# EAGLE board Controller-b (EAGLE 6.3)
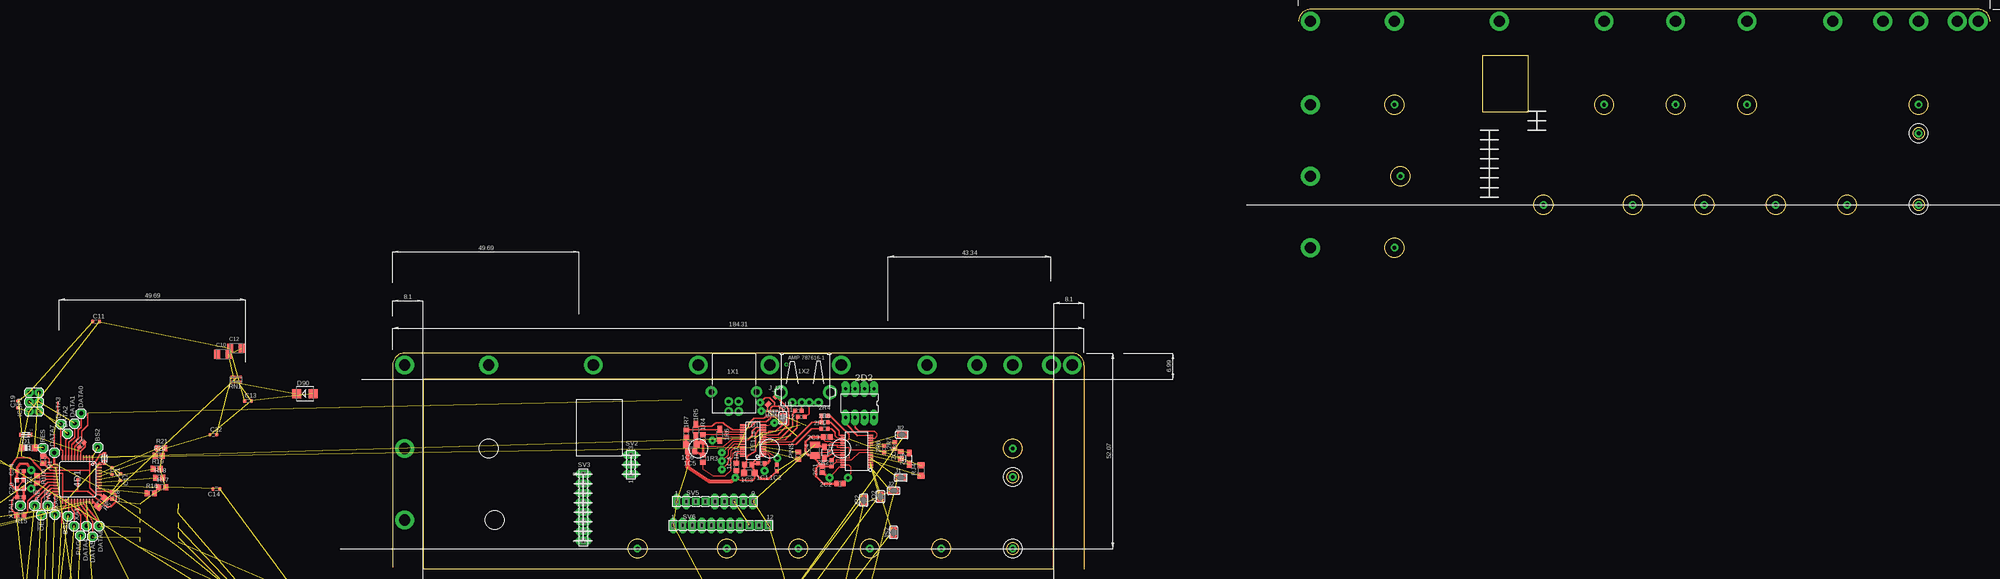
[diagram p8: board, top side]
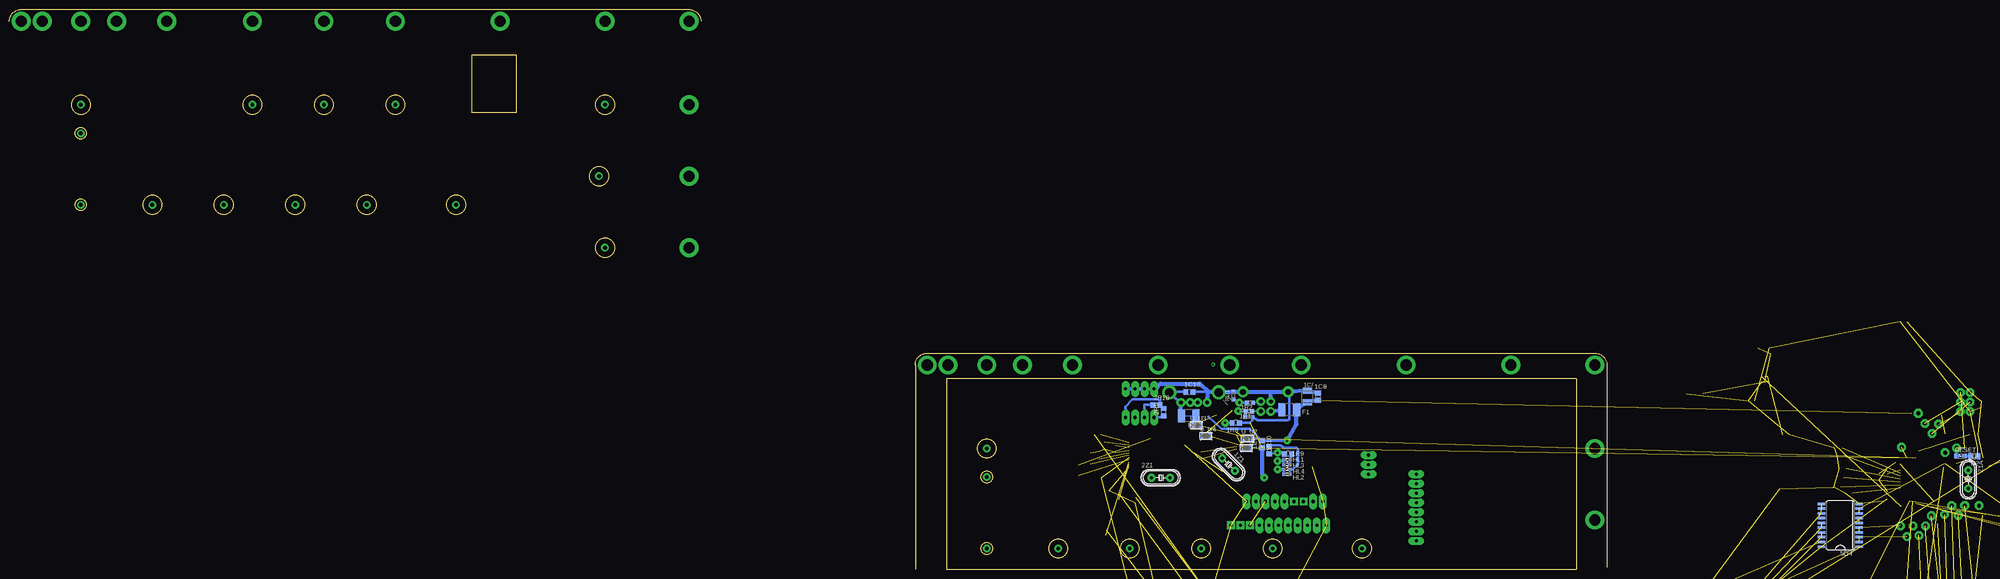
[diagram p9: board, bottom side, seen from below]

Size 425.77 x 149.22 mm. Coordinates in mm from the lower left corner, seen from the top.
Outline: 425.77,146.05 arc90 422.59,149.23 244.63,149.23 arc90 241.46,146.05
Outline: 0,0.64 0,54.45 arc-90 3.17,57.63 181.13,57.63 arc-90 184.31,54.45 184.31,0
Outline: 8.1,50.8 176.05,50.8 176.05,0 8.1,0 8.1,50.8
Outline: 290.51,137 302.58,137 302.58,121.76 290.51,121.76 290.51,137
Outline: circle at 165.26,5.56 radius 1.5
Outline: circle at 146.21,5.56 radius 2.5
Outline: circle at 127.16,5.56 radius 2.5
Outline: circle at 108.11,5.56 radius 2.5
Outline: circle at 89.06,5.56 radius 2.5
Outline: circle at 165.26,24.61 radius 1.5
Outline: circle at 165.26,32.23 radius 2.5
Outline: circle at 65.25,5.56 radius 2.5
Outline: circle at 406.72,97.16 radius 1.5
Outline: circle at 387.67,97.16 radius 2.5
Outline: circle at 368.62,97.16 radius 2.5
Outline: circle at 349.57,97.16 radius 2.5
Outline: circle at 330.52,97.16 radius 2.5
Outline: circle at 267.02,85.72 radius 2.5
Outline: circle at 268.6,104.78 radius 2.5
Outline: circle at 267.02,123.83 radius 2.5
Outline: circle at 406.72,116.21 radius 1.5
Outline: circle at 361,123.83 radius 2.5
Outline: circle at 341.95,123.83 radius 2.5
Outline: circle at 322.9,123.83 radius 2.5
Copper layers (1*16): Top 0.035mm / dielectric 1.5mm / Bottom 0.035mm
Design rules "DesignRules": minimum track width 8mil, minimum drill 24mil, track to track 0.2mm, track to pad 0.2mm, pad to pad 8mil, via to via 8mil, smd to smd 8mil, copper to edge 10mil, drill to drill 8mil, minimum pad ring 0.65mm, minimum via ring 8mil, stop-mask expansion 4mil, vias tented up to drill 0mil, thermal gap 10mil
Net classes: 1 power: width 0.254 mm, drill 0.61 mm, clearance 0.254 mm; 2 gnd: width 0.305 mm, drill 0.559 mm, clearance 0.254 mm; 3 usbvcc: width 0.508 mm, drill 0.61 mm, clearance 0.254 mm; 4 aref: width 0.254 mm, drill 0.61 mm, clearance 0.254 mm

## Footprints (pad centres in the part's own frame; a part is rotated, then mirrored left to right if it is on the bottom)
C0603 = smd 1.1 x 1: 1 -0.85,0; 2 0.85,0
C1206 = smd 1.6 x 1.8: 1 -1.4,0; 2 1.4,0
C0805 = smd 1.3 x 1.5: 1 -0.95,0; 2 0.95,0
SMC_B = smd 1.6 x 2.4: + -1.5,0; - 1.5,0
FE1.1S_SSOP-28 = smd 0.35 x 1.5: 1 -4.16,-2.7; 2 -3.52,-2.7; 3 -2.88,-2.7; 4 -2.24,-2.7; 5 -1.6,-2.7; 6 -0.96,-2.7; 7 -0.32,-2.7; 8 0.32,-2.7; 9 0.96,-2.7; 10 1.6,-2.7; 11 2.24,-2.7; 12 2.88,-2.7; 13 3.52,-2.7; 14 4.16,-2.7; 15 4.16,2.7; 16 3.52,2.7; 17 2.88,2.7; 18 2.24,2.7; 19 1.6,2.7; 20 0.96,2.7; 21 0.32,2.7; 22 -0.3,2.7; 23 -0.96,2.7; 24 -1.6,2.7; 25 -2.24,2.7; 26 -2.88,2.7; 27 -3.52,2.7; 28 -4.16,2.7
R0603 = smd 1 x 1.1: 1 -0.85,0; 2 0.85,0
R0805 = smd 1.3 x 1.5: 1 -0.95,0; 2 0.95,0
R1206W = smd 1.8 x 1.2: 1 -1.499,0; 2 1.499,0
M0805 = smd 1.3 x 1.6: 1 -0.95,0; 2 0.95,0
R1206 = smd 1.6 x 1.803: 1 -1.422,0; 2 1.422,0
M1206 = smd 1.6 x 2: 1 -1.4,0; 2 1.4,0
SMB = smd 2.4 x 2.4: A 2.2,0; C -2.2,0
SOT23 = smd 1 x 1.4: 1 -0.95,-1.1; 2 0.95,-1.1; 3 0,1.1
SOT23-BEC = smd 1 x 1.4: B -0.95,-1.1; C 0,1.1; E 0.95,-1.1
USB-B_PN61729-S = drill 1 pad 2: 1 1.409,5.186; 2 -1.25,5.186; 3 -1.25,2.551; 4 1.409,2.551 | drill 1.5 pad 3: S1 -6.02,0; S2 6.02,0
USB_TYPE_A_FEMALE_TH = drill 1: 1 -3.5,5.37; 2 -1,5.37; 3 1,5.37; 4 3.5,5.37 | drill 2.286: P$1 -6.57,2.66; P$2 6.57,2.66
HC49/S = drill 0.813: 1 -2.413,0; 2 2.413,0
C0805' = smd 1.3 x 1.5: 1 -0.85,0; 2 0.85,0
C1210 = smd 1.6 x 2.7: 1 -1.4,0; 2 1.4,0
SSOP28DB = smd 0.348 x 1.397: 1 -4.225,-3.656; 2 -3.575,-3.656; 3 -2.925,-3.656; 4 -2.275,-3.656; 5 -1.625,-3.656; 6 -0.975,-3.656; 7 -0.325,-3.656; 8 0.325,-3.656; 9 0.975,-3.656; 10 1.625,-3.656; 11 2.275,-3.656; 12 2.925,-3.656; 13 3.575,-3.656; 14 4.225,-3.656; 15 4.225,3.656; 16 3.575,3.656; 17 2.925,3.656; 18 2.275,3.656; 19 1.625,3.656; 20 0.975,3.656; 21 0.325,3.656; 22 -0.325,3.656; 23 -0.975,3.656; 24 -1.625,3.656; 25 -2.275,3.656; 26 -2.925,3.656; 27 -3.575,3.656; 28 -4.225,3.656
DIL8 = drill 0.813 long: 1 -3.81,-3.81; 2 -1.27,-3.81; 3 1.27,-3.81; 4 3.81,-3.81; 5 3.81,3.81; 6 1.27,3.81; 7 -1.27,3.81; 8 -3.81,3.81
C025-024X044 = drill 0.813 octagon: 1 -1.27,0; 2 1.27,0
C025-025X050 = drill 0.813 octagon: 1 -1.27,0; 2 1.27,0
RCL_E3,5-8 = drill 0.813 pad 3: + -1.778,0 | drill 0.813 pad 3 octagon: - 1.778,0
TQFP32-08 = smd 1.27 x 0.559: 1 -4.293,2.8; 2 -4.293,2; 3 -4.293,1.2; 4 -4.293,0.4; 5 -4.293,-0.4; 6 -4.293,-1.2; 7 -4.293,-2; 8 -4.293,-2.8; 17 4.293,-2.8; 18 4.293,-2; 19 4.293,-1.2; 20 4.293,-0.4; 21 4.293,0.4; 22 4.293,1.2; 23 4.293,2; 24 4.293,2.8 | smd 0.559 x 1.27: 9 -2.8,-4.293; 10 -2,-4.293; 11 -1.2,-4.293; 12 -0.4,-4.293; 13 0.4,-4.293; 14 1.2,-4.293; 15 2,-4.293; 16 2.8,-4.293; 25 2.8,4.293; 26 2,4.293; 27 1.2,4.293; 28 0.4,4.293; 29 -0.4,4.293; 30 -1.2,4.293; 31 -2,4.293; 32 -2.8,4.293
0207/10 = drill 0.813 octagon: 1 -5.08,0; 2 5.08,0
SMARTPRJ_TQFP44-PAD = smd 1.4 x 0.45: 1 -5.8,4; 2 -5.8,3.2; 3 -5.8,2.4; 4 -5.8,1.6; 5 -5.8,0.8; 6 -5.8,0; 7 -5.8,-0.8; 8 -5.8,-1.6; 9 -5.8,-2.4; 10 -5.8,-3.2; 11 -5.8,-4; 23 5.8,-4; 24 5.8,-3.2; 25 5.8,-2.4; 26 5.8,-1.6; 27 5.8,-0.8; 28 5.8,0; 29 5.8,0.8; 30 5.8,1.6; 31 5.8,2.4; 32 5.8,3.2; 33 5.8,4 | smd 0.45 x 1.4: 12 -4,-5.8; 13 -3.2,-5.8; 14 -2.4,-5.8; 15 -1.6,-5.8; 16 -0.8,-5.8; 17 0,-5.8; 18 0.8,-5.8; 19 1.6,-5.8; 20 2.4,-5.8; 21 3.2,-5.8; 22 4,-5.8; 34 4,5.8; 35 3.2,5.8; 36 2.4,5.8; 37 1.6,5.8; 38 0.8,5.8; 39 0,5.8; 40 -0.8,5.8; 41 -1.6,5.8; 42 -2.4,5.8; 43 -3.2,5.8; 44 -4,5.8 | smd 1 x 1: P$1 0,0
SUPER-SOT3 = smd 1 x 1.4: 1 -0.95,-1.1; 2 0.95,-1.1; 3 0,1.1
TQFP44 = smd 1.5 x 0.5: 1 -5.8,4; 2 -5.8,3.2; 3 -5.8,2.4; 4 -5.8,1.6; 5 -5.8,0.8; 6 -5.8,0; 7 -5.8,-0.8; 8 -5.8,-1.6; 9 -5.8,-2.4; 10 -5.8,-3.2; 11 -5.8,-4; 23 5.8,-4; 24 5.8,-3.2; 25 5.8,-2.4; 26 5.8,-1.6; 27 5.8,-0.8; 28 5.8,0; 29 5.8,0.8; 30 5.8,1.6; 31 5.8,2.4; 32 5.8,3.2; 33 5.8,4 | smd 0.5 x 1.5: 12 -4,-5.8; 13 -3.2,-5.8; 14 -2.4,-5.8; 15 -1.6,-5.8; 16 -0.8,-5.8; 17 0,-5.8; 18 0.8,-5.8; 19 1.6,-5.8; 20 2.4,-5.8; 21 3.2,-5.8; 22 4,-5.8; 34 4,5.8; 35 3.2,5.8; 36 2.4,5.8; 37 1.6,5.8; 38 0.8,5.8; 39 0,5.8; 40 -0.8,5.8; 41 -1.6,5.8; 42 -2.4,5.8; 43 -3.2,5.8; 44 -4,5.8
SO16 = smd 0.66 x 2.032: 1 -4.445,-3.073; 2 -3.175,-3.073; 3 -1.905,-3.073; 4 -0.635,-3.073; 5 0.635,-3.073; 6 1.905,-3.073; 7 3.175,-3.073; 8 4.445,-3.073; 9 4.445,3.073; 10 3.175,3.073; 11 1.905,3.073; 12 0.635,3.073; 13 -0.635,3.073; 14 -1.905,3.073; 15 -3.175,3.073; 16 -4.445,3.073
SOIC8 = smd 0.6 x 2.2: 1 -1.905,-2.6; 2 -0.635,-2.6; 3 0.635,-2.6; 4 1.905,-2.6; 5 1.905,2.6; 6 0.635,2.6; 7 -0.635,2.6; 8 -1.905,2.6
SO20W = smd 0.66 x 2.032: 1 -5.715,-5.029; 2 -4.445,-5.029; 3 -3.175,-5.029; 4 -1.905,-5.029; 5 -0.635,-5.029; 6 0.635,-5.029; 7 1.905,-5.029; 8 3.175,-5.029; 9 4.445,-5.029; 10 5.715,-5.029; 11 5.715,5.029; 12 4.445,5.029; 13 3.175,5.029; 14 1.905,5.029; 15 0.635,5.029; 16 -0.635,5.029; 17 -1.905,5.029; 18 -3.175,5.029; 19 -4.445,5.029; 20 -5.715,5.029
SO14 = smd 0.66 x 2.032: 1 -3.81,-3.073; 2 -2.54,-3.073; 3 -1.27,-3.073; 4 0,-3.073; 5 1.27,-3.073; 6 2.54,-3.073; 7 3.81,-3.073; 8 3.81,3.073; 9 2.54,3.073; 10 1.27,3.073; 11 0,3.073; 12 -1.27,3.073; 13 -2.54,3.073; 14 -3.81,3.073
1X01 = drill 1.016 octagon: 1 0,0
C0603-ROUND = smd 0.898 x 1.1: 1 -0.889,0; 2 0.889,0
MINIMELF = smd 1.4 x 1.8: A 1.7,0; C -1.7,0
SOD80C = smd 1.4 x 1.8 bottom: A -1.7,0; C 1.7,0
L1812 = smd 1.9 x 3.4: 1 -1.95,0; 2 1.95,0
SML0603 = smd 0.8 x 0.8: A 0.75,0; C -0.75,0
PINHEAD_1X02 = drill 1.016 pad 2.3: 1 -1.27,0; 2 1.27,0
2X03 = drill 0.95 pad 1.55 octagon: 1 -2.54,-1.27; 2 -2.54,1.27; 3 0,-1.27; 4 0,1.27; 5 2.54,-1.27; 6 2.54,1.27
1X08 = drill 0.85 pad 1.422 long: 1 -8.89,0; 2 -6.35,0; 3 -3.81,0; 4 -1.27,0; 5 1.27,0; 6 3.81,0; 7 6.35,0; 8 8.89,0
MA03-2 = drill 1.016: 1 -2.54,-1.27 | drill 1.016 octagon: 2 -2.54,1.27; 3 0,-1.27; 4 0,1.27; 5 2.54,-1.27; 6 2.54,1.27
SJ = smd 1.168 x 1.6: 1 -0.762,0; 2 0.762,0
R1206W' = smd 1.5 x 1.2 bottom: 1 1.499,0; 2 -1.499,0
JUMPER_JP2 = drill 0.914 pad 2.3 octagon: 1 -2.54,0; 2 0,0; 3 2.54,0
JP2 = drill 0.914 long: 1 -2.54,0; 2 0,0; 3 2.54,0
0805 = smd 1.2 x 1: 1 -1.1,0; 2 1.1,0
JP1 = drill 0.914 long: 1 0,-1.27; 2 0,1.27
HC49/S' = drill 0.813 pad 2.9: 1 -2.413,0; 2 2.413,0
A0R-JMP = smd 1.5 x 1.3: 1 0,1.7; 2 0,0; 3 0,-1.7
SML0805 = smd 1.2 x 1.2: A 1.05,0; C -1.05,0
TS42 = smd 1.6 x 1.4: 1 -4.2,2.25; 2 4.2,2.25; 3 -4.2,-2.25; 4 4.2,-2.25; 5 -4.2,0
CAY16 = smd 0.5 x 0.65: 1 -1.2,-0.675; 2 -0.4,-0.675; 3 0.4,-0.675; 4 1.2,-0.675; 5 1.2,0.675; 6 0.4,0.675; 7 -0.4,0.675; 8 -1.2,0.675
CT/CN0603 = smd 1 x 1: 1 -1,0; 2 1,0
FE03-1 = drill 0.813 pad 2.1 long: 1 -2.54,0; 2 0,0; 3 2.54,0
FE08 = drill 0.813 pad 2.1 long: 1 -8.89,0; 2 -6.35,0; 3 -3.81,0; 4 -1.27,0; 5 1.27,0; 6 3.81,0; 7 6.35,0; 8 8.89,0
FE09 = drill 0.813 pad 2.1 long: 1 -10.16,0; 2 -7.62,0; 5 0,0; 6 2.54,0; 7 5.08,0; 8 7.62,0; 9 10.16,0 | drill 0.813 pad 2.1 square: 3 -5.08,0; 4 -2.54,0
FE12 = drill 0.813 pad 2.1 long: 1 -13.97,0; 2 -11.43,0; 3 -8.89,0; 4 -6.35,0; 5 -3.81,0; 6 -1.27,0; 7 1.27,0; 8 3.81,0 | drill 0.813 pad 2.1 square: 9 6.35,0; 10 8.89,0; 11 11.43,0
CRYSTAL-3.2-2.5 = smd 1.3 x 1.05: 1 -1.15,-0.925; 2 1.15,-0.925; 3 1.15,0.925; 4 -1.15,0.925
HC49U-V = drill 0.813: 1 -2.413,0; 2 2.413,0

## Placement (x,y rotation side)
1C1  22  [C0603]  98.27,28.26 0 top
1C2  22  [C0603]  102.39,26.99 90 top
1C3  10m  [C1206]  95.09,25.72 0 top
1C4  100n  [C0805]  94.77,27.94 0 top
1C5  100n  [C0805]  79.53,31.43 180 top
1C6  10m  [C1206]  79.53,33.34 180 top
1C7  10u  [SMC_B]  79.85,46.04 90 bottom
1C8  100n  [C0805]  76.99,46.04 270 bottom
1C9  100n  [C0805]  91.92,33.34 90 bottom
1C10  100n  [C0805]  111.28,47.31 0 bottom
1C13  100n  [C0805]  -93.19,-296.07 0 top  (outside the outline)
1C14  100n  [C0805]  -114.78,-305.59 0 top  (outside the outline)
1C19  100n  [C0805]  -15.72,-120.81 0 bottom  (outside the outline)
1C20  33p  [C0805]  -26.04,-8.25 180 bottom  (outside the outline)
1C21  33p  [C0805]  -26.04,-4.44 180 bottom  (outside the outline)
1C22  100n  [C0805]  -34.77,-120.81 0 bottom  (outside the outline)
1C23  100n  [C0805]  -41.12,-120.81 0 bottom  (outside the outline)
1C24  100n  [C0805]  -47.47,-120.81 0 bottom  (outside the outline)
1D1  FE1.1S  [FE1.1S_SSOP-28]  96.04,34.29 90 top
1R1  10  [R0603]  95.41,42.07 180 bottom
1R2  10  [R0603]  95.09,44.45 180 bottom
1R3  100k  [R0805]  82.71,29.53 270 top
1R4  100k  [R0805]  82.71,34.92 90 top
1R5  100k  [R1206W]  80.8,37.15 90 top
1R6  47k  [R1206W]  87.15,35.88 270 top
1R7  100k  [R0805]  78.26,36.2 90 top
1R8  2k7  [R0805]  98.9,39.05 180 bottom
1R9  1k  [R0805]  84.93,30.8 180 bottom
1R10  1k  [R0805]  90.01,31.75 270 bottom
1R11  10  [R0603]  108.11,42.23 0 top
1R12  10  [R0603]  108.9,40.64 0 top
1R14  10k  [M0805]  68.1,-47.78 90 top  (outside the outline)
1R15  10k  [M0805]  78.26,-59.85 0 top  (outside the outline)
1R16  10k  [M0805]  78.26,-48.42 0 top  (outside the outline)
1R17  10k  [M0805]  64.93,-47.78 90 top  (outside the outline)
1R28  10k  [R0805]  -20.8,-114.46 0 bottom  (outside the outline)
1R29  10k  [M0805]  -53.82,-120.81 0 bottom  (outside the outline)
1R30  10k  [M0805]  -60.17,-120.81 0 bottom  (outside the outline)
1R31  10k  [M0805]  -66.52,-120.81 0 bottom  (outside the outline)
1R32  1k  [M0805]  -72.87,-120.81 0 bottom  (outside the outline)
1R33  1k5  [M0805]  -46.2,-36.99 0 bottom  (outside the outline)
1R34  1k5  [M0805]  -47.47,-40.8 0 bottom  (outside the outline)
1R35  36k  [M0805]  -28.42,-127.16 0 bottom  (outside the outline)
1R36  150k  [R1206]  -28.42,-114.46 0 bottom  (outside the outline)
1R37  10k  [M0805]  -34.77,-127.16 0 bottom  (outside the outline)
1R38  10k  [M0805]  -39.85,-101.76 0 bottom  (outside the outline)
1R39  47k  [M0805]  -47.47,-127.16 0 bottom  (outside the outline)
1R40  2k  [R1206W]  -32.86,-55.4 90 bottom  (outside the outline)
1R41  10k  [M0805]  -61.44,-125.89 0 bottom  (outside the outline)
1R42  22k  [M1206]  -34.77,-114.46 0 bottom  (outside the outline)
1RJ  [R0805]  91.6,27.31 270 top
1VD3  SB130  [SMB]  -32.23,-97.95 0 bottom  (outside the outline)
1VT4  BC847  [SOT23]  -15.72,-106.84 0 bottom  (outside the outline)
1VT5  BC857  [SOT23-BEC]  -23.34,-106.84 0 bottom  (outside the outline)
1VT6  BC847  [SOT23]  -30.96,-106.84 0 bottom  (outside the outline)
1X1  USB-B_PN61729-S  [USB-B_PN61729-S]  90.96,47.31 180 top
1X2  USB_TYPE_A_FEMALE_TH  [USB_TYPE_A_FEMALE_TH]  110.01,49.85 180 top
1Z1  12MHz  [HC49/S]  100.81,27.94 135 bottom
2C1  20  [C0805']  114.46,26.67 270 top
2C2  20  [C0805']  119.22,22.86 0 top
2C3  100n  [C0805']  115.73,35.24 180 top
2C4  10mf  [C1210]  112.55,31.75 90 top
2C5  1mf  [C0805]  135.41,30.48 90 top
2D1  PL-2303XA  [SSOP28DB]  123.67,31.43 90 top
2D2  24C02CP  [DIL8]  124.46,44.29 180 top
2R1  100  [R0603]  115.09,37.47 0 top
2R2  220k  [R0603]  117,28.26 90 top
2R3  220k  [R1206W]  115.09,31.11 270 top
2R4  1.5k  [R0603]  115.09,40.96 180 top
2R5  220k  [R1206W]  137.64,29.53 90 top
2R6  220k  [R0603]  130.97,32.07 90 top
2R7  220k  [R0603]  133.83,33.02 90 top
2R8  100  [R0603]  115.09,39.21 0 top
2R9  [R0805]  118.11,41.91 90 bottom
2R10  [R0805]  120.02,43.82 0 bottom
2Z1  12MHz  [HC49/S]  118.9,24.45 0 bottom
3C6  100n  [C025-024X044]  3.33,-78.9 270 bottom  (outside the outline)
3C7  1n  [C025-025X050]  7.14,-82.71 0 bottom  (outside the outline)
3C8  470µ / 10V  [RCL_E3,5-8]  -3.02,-81.44 270 bottom  (outside the outline)
3C9  100µ 16V  [RCL_E3,5-8]  -6.98,-6.98 270 bottom  (outside the outline)
3C10  100n  [C025-025X050]  -6.83,-73.82 180 bottom  (outside the outline)
3D2  ATMEGA168-AU  [TQFP32-08]  -95.73,-280.19 0 top  (outside the outline)
3L2  100uh  [0207/10]  22.38,-72.55 270 bottom  (outside the outline)
3R5  220  [R1206]  12.22,-66.2 0 bottom  (outside the outline)
3R6  0.5-1  [M1206]  7.14,-63.66 180 bottom  (outside the outline)
3R7  20k  [M0805]  0.79,-64.93 0 bottom  (outside the outline)
3R8  2k2  [M0805]  2.06,-72.55 90 bottom  (outside the outline)
3VD2  SS12  [SMB]  14.76,-77.63 90 bottom  (outside the outline)
4C2  10n  [C1206]  -15.72,-133.51 0 bottom  (outside the outline)
4D1  ATMEGA32U4  [SMARTPRJ_TQFP44-PAD]  -83.98,23.97 270 top  (outside the outline)
4R6  1.5k  [M0805]  -36.04,-133.51 0 bottom  (outside the outline)
4R7  10k  [M0805]  -36.04,-104.3 0 bottom  (outside the outline)
4R8  2k2  [M1206]  -20.8,-133.51 0 bottom  (outside the outline)
4R9  2k2  [M0805]  -53.82,-130.97 0 bottom  (outside the outline)
4R10  1k  [M0805]  -61.44,-108.11 0 bottom  (outside the outline)
4VT4  BC847  [SOT23]  -38.58,-106.84 0 bottom  (outside the outline)
4VT5  IRML6402  [SUPER-SOT3]  -53.82,-97.95 0 bottom  (outside the outline)
4VT6  IRML2502  [SOT23]  -63.98,-97.95 0 bottom  (outside the outline)
5D1  MEGA8535-A  [TQFP44]  -25.08,-25.24 270 bottom  (outside the outline)
5D2  74HC165D  [SO16]  -24.92,-40.8 180 bottom  (outside the outline)
5D3  MC34063AD  [SOIC8]  8.41,-72.55 0 bottom  (outside the outline)
5D4  74HC244DW  [SO20W]  -62.23,11.75 90 bottom  (outside the outline)
5D5  4011D  [SO14]  103.03,-31.91 270 top  (outside the outline)
5D6  74HC244DW  [SO20W]  117.16,-31.75 0 top  (outside the outline)
!OE  [1X01]  -93.66,14.45 90 top  (outside the outline)
!WR  [1X01]  -91.92,16.99 90 top  (outside the outline)
BS1  [1X01]  -86.52,14.29 90 top  (outside the outline)
BS2  [1X01]  -78.58,32.54 90 top  (outside the outline)
C1  100n  [C0603-ROUND]  -74.77,26.19 270 top  (outside the outline)
C2  1uF  [C0603]  -82.87,33.18 45 top  (outside the outline)
C3  22  [C0805]  -109.06,-305.59 0 top  (outside the outline)
C4  22  [C0805]  -104.62,-305.59 0 top  (outside the outline)
C10  10u  [SMC_B]  -45.24,57.31 0 top  (outside the outline)
C11  1u  [C0603-ROUND]  -79.06,66.04 0 top  (outside the outline)
C12  10u  [SMC_B]  -41.75,58.9 0 top  (outside the outline)
C13  100n  [C0603-ROUND]  -38.58,44.93 0 top  (outside the outline)
C14  1u  [C0603-ROUND]  -46.99,21.43 180 top  (outside the outline)
C17  1uF  [C0603-ROUND]  -72.55,24.61 270 top  (outside the outline)
C18  100n  [C0603]  -74.77,19.69 90 top  (outside the outline)
C19  100n  [C0603-ROUND]  -99.85,43.97 90 top  (outside the outline)
C20  22p  [C0603]  -99.22,19.21 0 top  (outside the outline)
C22  100n  [C0603-ROUND]  -47.78,35.88 0 top  (outside the outline)
C24  22p  [C0603]  -99.22,26.19 0 top  (outside the outline)
D1  CD1206-S01575  [MINIMELF]  -97.16,32.39 0 top  (outside the outline)
D2  LL4148  [SOD80C]  79.53,-51.28 0 top  (outside the outline)
D3  LL4148  [SOD80C]  79.53,-57.31 0 top  (outside the outline)
D6  LL4148  [SOD80C]  70.01,-58.58 180 top  (outside the outline)
D7  LL4148  [SOD80C]  63.66,-59.21 0 top  (outside the outline)
D8  LL4148  [SOD80C]  61.75,-54.13 90 top  (outside the outline)
D9  LL4148  [SOD80C]  68.1,-51.59 180 top  (outside the outline)
D10  LL4148  [SOD80C]  69.37,-78.9 0 top  (outside the outline)
D11  LL4148  [SOD80C]  59.21,-75.72 0 top  (outside the outline)
D90  M7  [SMB]  -23.34,46.83 0 top  (outside the outline)
DATA0  [1X01]  -83.03,41.59 90 top  (outside the outline)
DATA1  [1X01]  -84.77,38.89 90 top  (outside the outline)
DATA2  [1X01]  -86.68,36.2 90 top  (outside the outline)
DATA3  [1X01]  -88.42,38.73 90 top  (outside the outline)
DATA4  [1X01]  -81.6,11.59 90 top  (outside the outline)
DATA5  [1X01]  -80.01,8.73 90 top  (outside the outline)
DATA6  [1X01]  -78.26,11.59 90 top  (outside the outline)
DATA7  [1X01]  -90.17,31.11 90 top  (outside the outline)
F1  MF-MSMF050-2 500mA  [L1812]  84.61,42.54 180 bottom
F2  MF-MSMF050-2 500mA  [L1812]  111.44,40.96 180 bottom
HL1  [SML0603]  85.25,29.21 0 bottom
HL2  [SML0603]  85.25,25.4 0 bottom
HL3  [SML0603]  85.25,27.94 180 bottom
HL4  [SML0603]  85.25,26.67 180 bottom
HW  yellow  [SML0603]  -32.7,-60.32 270 bottom  (outside the outline)
HW1  High Voltage Enable  [PINHEAD_1X02]  -44.29,-97.31 270 bottom  (outside the outline)
IC2  74HC595D  [SO16]  -109.7,-230.03 0 top  (outside the outline)
IC3  74HC595D  [SO16]  -96.36,-230.03 0 top  (outside the outline)
IC4  74HC595D  [SO16]  -109.7,-238.92 0 top  (outside the outline)
IC5  74HC595D  [SO16]  -96.36,-238.92 0 top  (outside the outline)
IC6  MEGA16-A  [TQFP44]  -110.33,-283.37 0 top  (outside the outline)
ICSP1  ICSP  [2X03]  -95.57,44.61 90 top  (outside the outline)
IOL1  8x1F-H8.5  [1X08]  -105.89,-247.17 0 top  (outside the outline)
IOL2  8x1F-H8.5  [1X08]  -105.89,-254.79 0 top  (outside the outline)
IOL3  8x1F-H8.5  [1X08]  -105.89,-262.41 0 top  (outside the outline)
IOL4  8x1F-H8.5  [1X08]  -105.89,-270.03 0 top  (outside the outline)
ISP1  [MA03-2]  -67.79,-70.01 0 bottom  (outside the outline)
ISP3  [MA03-2]  -112.87,-297.34 0 top  (outside the outline)
J1  [SJ]  135.41,24.45 0 top
J2  [SJ]  133.51,20.96 0 top
J5  [SJ]  8.41,-90.33 0 bottom  (outside the outline)
J6  [SJ]  -0.48,-95.41 0 bottom  (outside the outline)
J_U1  [SJ]  103.98,40.32 90 top
J_U2  J  [R1206W']  101.12,45.09 315 bottom
JI2  [SJ]  135.73,35.88 0 top
JO2  [SJ]  130.02,19.37 90 top
JP1  Selfprogramming  [JUMPER_JP2]  -16.99,-97.95 0 bottom  (outside the outline)
JP2  [JP2]  74.45,-54.13 90 top  (outside the outline)
JR2  [SJ]  125.57,18.42 90 top
JS2  [SJ]  133.51,9.84 90 top
JV1  [SJ]  -61.44,-136.05 0 bottom  (outside the outline)
JX1  [SJ]  -63.98,-85.25 0 bottom  (outside the outline)
L1  MH2029-300Y  [0805]  -97.79,35.88 180 top  (outside the outline)
L3  MH2029-300Y  [0805]  -76.83,29.53 270 top  (outside the outline)
LED  red  [SML0603]  -32.38,-42.54 0 bottom  (outside the outline)
LEDS  [2X03]  -112.87,11.43 0 top  (outside the outline)
P_RESET  [JP1]  -112.55,32.54 0 top  (outside the outline)
PAG  [1X01]  -83.19,9.05 90 top  (outside the outline)
PINS  [R0805]  108.11,30.32 90 top
Q1  16M  [HC49/S']  -101.44,-297.34 0 top  (outside the outline)
R1  10k  [M0805]  -93.19,29.21 270 top  (outside the outline)
R2  10k  [M0805]  -97.95,30.16 180 bottom  (outside the outline)
R3  [R0805]  -100.17,-305.59 0 top  (outside the outline)
R4  10k  [M0805]  -68.42,-7.46 270 top  (outside the outline)
R5  10k  [M1206]  -77.63,17.78 50 top  (outside the outline)
R6  10k  [M0805]  -79.69,-9.21 270 top  (outside the outline)
R7  10k  [M0805]  -83.98,-7.78 270 top  (outside the outline)
R8  10k  [M0805]  -86.2,-7.62 270 top  (outside the outline)
R9  10k  [M0805]  -90.8,-6.67 270 top  (outside the outline)
R10  10k  [M0805]  -88.9,-7.46 270 top  (outside the outline)
R11  10k  [M0805]  -92.71,-6.83 270 top  (outside the outline)
R12  10k  [M0805]  -94.77,-6.51 270 top  (outside the outline)
R13  10k  [M0805]  -97.79,-6.51 270 top  (outside the outline)
R15  10k  [M0805]  -99.22,14.45 180 top  (outside the outline)
R16  10k  [M0805]  -64.45,20.32 0 top  (outside the outline)
R17  10k  [M0805]  -61.44,21.91 0 top  (outside the outline)
R18  10k  [M0805]  -62.23,24.45 0 top  (outside the outline)
R19  10k  [M0805]  -62.86,26.83 0 top  (outside the outline)
R20  10k  [M0805]  -62.39,30.32 0 top  (outside the outline)
R21  10k  [M0805]  -61.75,32.23 0 top  (outside the outline)
R100  1M  [C0805]  -94.77,23.97 270 top  (outside the outline)
R/!B  [1X01]  -95.41,16.99 90 top  (outside the outline)
READY  green  [SML0603]  -32.38,-45.08 0 bottom  (outside the outline)
RES  [1X01]  -93.19,32.39 90 top  (outside the outline)
RES1  0R-JUMPA  [A0R-JMP]  -15.72,-92.87 270 bottom  (outside the outline)
RESET  [SML0805]  -94.3,30.16 0 bottom  (outside the outline)
RESET1  TS42  [TS42]  -84.3,-30.64 270 top  (outside the outline)
RESET2  TS42  [TS42]  -91.76,-30.8 270 top  (outside the outline)
RJ4  0  [R1206]  140.81,26.35 90 top
RN  22R  [CAY16]  101.12,41.59 0 top
RN1  10K  [CAY16]  -41.75,50.64 0 top  (outside the outline)
RU1  CG0603MLC-05E  [CT/CN0603]  99.54,46.35 90 bottom
RU2  CG0603MLC-05E  [CT/CN0603]  95.41,40.64 0 bottom
SV2  [FE03-1]  63.5,27.94 90 top
SV3  [FE08]  50.8,16.51 90 top
SV5  CON_KB_N  [FE09]  85.88,18.1 0 top
SV6  [FE12]  88.74,11.75 0 top
T_RESET  [JP1]  -33.18,-34.92 0 top  (outside the outline)
U_U1  [SJ]  96.04,32.39 0 bottom
U_U2  [SJ]  95.73,34.92 0 bottom
U_U3  [SJ]  109.38,38.42 0 bottom
U_U4  [SJ]  106.84,35.56 0 bottom
XA0  [1X01]  -90.01,14.61 90 top  (outside the outline)
XA1  [1X01]  -84.93,11.59 90 top  (outside the outline)
XTAL1  [1X01]  -99.22,16.99 90 top  (outside the outline)
Z1  16MHz KX-7  [CRYSTAL-3.2-2.5]  -99.22,22.7 270 top  (outside the outline)
Z1A  16MHz  [HC49/S]  -96.36,23.97 270 bottom  (outside the outline)
Z3  7,3728MHz  [HC49U-V]  -20.96,-9.53 0 bottom  (outside the outline)

## Tracks (layer width: path | path; a pad name or v marks a point on that pad's centre or on a via)
3VUSB2  (1 unrouted)
  Top 0.305: 2C3.1 118.1,34.36 2D1.17 121.19,34.36 121.66,34.82
  Top 0.406: 121.66,34.82 121.66,35.98 120.65,36.99 120.33,37.15 116.52,40.96 2R4.1
5-GND  (1 unrouted)
!HVPP_EN  (4 unrouted)
!ISP_EN  (4 unrouted)
!OE741  (4 unrouted)
!OE!(UPD2)  (1 unrouted)
  Top 0.406: 4D1.20 -90.98,21.57 -93.66,18.89 !OE.1
+5V  (55 unrouted)
  Top 0.305: 118.62,29.81 2D1.24 121.76,29.81 121.76,31.75 | 2D1.19 118.59,33.06 118.59,32.41 2D1.20 121.76,32.41 121.76,31.75 | 2D1.8 127.32,31.75 121.76,31.75
  Top 0.406: -80.78,26.37 4D1.14 -91.3,26.37 R1.2 | -80.78,26.37 -80.78,27.78 | -80.78,27.78 4D1.2 | -80.78,26.37 -80.78,21.72 -79.03,19.97 4D1.34 R5.2 C18.1 | L3.1 -77.96,30.63 -78.9,29.21 -79.85,27.94 -80.78,27.78 | 2R3.1 115.54,33.06 118.59,33.06
  Top 0.61: 2C4.2 2R3.1
+12V  (5 unrouted)
AREF  (1 unrouted)
AVCC  (3 unrouted)
  Top 0.406: L3.2 -78.18,28.5 4D1.44 | 4D1.24 -87.18,16.96 -88.27,15.88 -88.27,12.22
CD2  (1 unrouted)
CMP  (2 unrouted)
CR+  (1 unrouted)
CR-  (1 unrouted)
D+  (via drill 0.6 pad 2)  (1 unrouted)
  Top 0.406: RN.7 100.72,42.95 101.28,43.5 101.76,43.5 | 101.76,43.5 103.03,43.5 103.98,42.55 J_U1.2 | v97.95,44.45 99.22,45.72 100.49,45.72 101.76,44.45 101.76,43.5
  Bottom 0.61: 1R2.2 v97.95,44.45 RU1.1
D-  (via drill 0.6 pad 2)  (1 unrouted)
  Top 0.406: v98.27,42.23 RN.8 99.92,43.89 J_U2.1
  Bottom 0.406: RU2.1 96.26,40.79 1R1.2
  Bottom 0.61: 1R1.2 v98.27,42.23
DMI
  Top 0.305: 1D1.15 94.49,38.45 94.84,38.81
  Top 0.406: 94.84,38.81 96.36,40.32 98.9,40.32 RN.1
DPI
  Top 0.305: 1D1.16 95.12,37.81 95.64,38.34
  Top 0.406: 95.64,38.34 96.68,39.37 99.54,39.37 100.72,40.24 RN.2
GND  (via drill 0.6 pad 2)  (93 unrouted)
  Top 0.305: Z1.2 Z1.4 | 1D1.1 98.23,30.13 96.68,29.21 | 2D1.26 118.27,28.51 | 118.27,28.51 118.27,29.16 2D1.25 122.34,29.16 124.29,31.11 2D1.7 | 118.27,28.51 118.12,28.51 117.43,27.83 2R2.1 | 2D1.21 116.67,31.76 115.73,31.12 114.14,31.12 113.38,30.93 2C4.1 | 2D1.18 116.95,33.71 116.68,33.97 115.41,33.97 114.88,34.51 2C3.2
  Top 0.406: 4D1.23 -87.98,20.77 | -87.98,20.77 -87.98,25.57 4D1.15 -92.88,25.57 -96.68,29.69 -100.17,29.69 -101.76,27.46 -101.76,22.7 -100.61,21.55 Z1.2 | -87.98,20.77 -83.98,20.77 | -83.98,20.77 -81.26,20.77 -76.2,16.67 -75.09,16.67 -73.66,18.1 -73.66,19.74 -74.69,20.77 | 1C3.2 96.49,24.26 96.04,23.81 92.55,23.81 v91.28,24.45 | 4D1.P$1 -83.98,20.77 | 96.68,29.21 1C4.2 | C20.1 -100.81,19.21 -101.6,18.42 -101.6,15.88 R15.2 | 4D1.35 -74.69,20.77 | -74.69,20.77 C18.2
  Top 0.61: Z1.2 C20.1 | Z1.4 C24.2 | 1C6.2 1R7.1 | 1C1.1 1C4.2 1C3.2 98.08,24.13 100.17,24.13 1C2.1 | 2R2.1 2C1.1 113.93,28.05 | 113.93,28.05 112.55,29.43 2C4.1 110.78,30.35 110.01,31.12 110.01,33.97 111.28,35.24 2C3.2 | 2C2.1 114.78,22.86 112.87,24.77 112.87,26.99 113.93,28.05
  Top 1.016: 1C6.2 1C5.2 78.58,27.3 84.3,23.5 90.33,23.5 v91.28,24.45 1RJ.2
  Bottom 0.406: 84.61,46.98 1X1.S2
  Bottom 0.61: 84.61,46.98 84.61,40.01 84.93,39.69 93.14,39.69 RU2.2 94.41,39.74 95.09,39.05 1R8.1 | 1X2.4 106.51,47.3 107.63,47.31 1C10.2
  Bottom 1.016: 89.55,47.31 1X1.S1 99.49,47.31 | 89.55,47.31 1X1.S2 1C7.- 1C8.1 | 1X1.4 89.55,47.31 | 1X2.4 106.22,47.31 | 106.22,47.31 99.49,47.31 | RU1.2 99.49,47.31 | 1C9.1 91.92,25.08 v91.28,24.45 | 2D2.1 2D2.2 2D2.3 2D2.4 120.17,48.1 118.9,49.53 108.45,49.53 106.22,47.31
HWB  (1 unrouted)
  Top 0.406: 4D1.33 R5.1
ID+
  Bottom 0.406: 1R2.1 1X1.3
ID-
  Bottom 0.406: 1R1.1 94.19,42.12 1X1.2
LED/!STK500  (4 unrouted)
MISO0  (1 unrouted)
MISO8535  (3 unrouted)
MOSI0  (1 unrouted)
MOSI8535  (3 unrouted)
N1  (2 unrouted)
N$1
  Top 0.406: -98.58,23.65 -98.27,23.65
N$2  (1 unrouted)
N$3
  Bottom 0.61: R2.2 RESET.A
N$4  (1 unrouted)
N$5
  Top 0.305: 1D1.9 103.67,35.25
  Top 0.406: 103.67,35.25 106.52,38.1 106.52,41.28 107.47,42.23 1R11.1
N$6
  Top 0.305: 1D1.8 104.62,34.61
  Top 0.406: 104.62,34.61 107.79,37.78 107.79,40.01 107.95,40.64 1R12.1
N$7
  Bottom 1.016: 1X1.1 F1.2
N$8
  Top 0.305: 1D1.2 99.88,30.77 100.49,30.16 100.49,28.89
  Top 0.61: 1Z1.1 1C1.2 99.85,28.26 100.49,28.89
N$9
  Top 0.305: 1D1.3 99.96,31.41 1Z1.2
  Top 0.61: 1C2.2 1Z1.2
N$10
  Top 0.305: 81.15,38.12 1R5.2
  Top 0.406: 1D1.17 90.62,37.17 88.42,38.74 88.11,39.05 86.2,39.05 84.93,38.1 80.81,38.1 1R5.2
N$11  (via drill 0.6 pad 2)
  Top 0.305: 1D1.22 90.66,33.99 v87.79,31.12
  Bottom 0.61: 1R9.2 v87.79,31.12 1R10.2
N$12
  Top 0.406: 1R11.2 108.96,43.15 1X2.3
N$13
  Top 0.406: 1X2.2 110.97,43.8 110.97,41.28 1R12.2
N$14  (via drill 0.6 pad 2)
  Top 0.305: 1D1.23 90.96,33.33 89.38,31.75 89.38,30.48 v87.79,28.89
  Bottom 0.61: HL3.A 86,28.89 | 86,28.89 HL1.C | v87.79,28.89 86,28.89
N$15
  Top 0.305: 1D1.19 89.71,35.89 88.42,35.88 82.39,35.88 1R4.2
N$16
  Top 0.305: 1D1.18 88.44,36.53 87.79,36.83 87.16,36.83 1R6.1
  Top 0.406: 1R7.2 79.85,37.15 86.2,37.15 1R6.1
N$17  (via drill 0.6 pad 2)
  Top 0.305: 1D1.24 91.27,32.69 90.01,31.43 90.01,30.16 89.38,29.53 89.38,28.26 v87.79,26.67
  Bottom 0.61: HL2.C HL4.A v87.79,26.67
N$18
  Bottom 0.61: HL2.A HL4.C 83.66,26.67 82.39,27.94 82.39,32.07 82.71,32.39 85.88,32.39 87.15,33.02 89.69,33.02 1R10.1
N$19
  Top 0.305: 1D1.26 91.26,31.41 90.65,30.8 90.65,29.85 90.01,29.21 90.01,26.35 88.42,24.77 85.57,24.77 82.71,26.67 1R3.2
N$20  (2 unrouted)
N$21  (via drill 0.6 pad 2)
  Top 0.305: 1D1.14 100.14,38.45 v101.76,39.05
  Bottom 0.61: 1R8.2 v101.76,39.05
N$23
  Top 0.305: 1D1.27 91.89,30.77 91.6,30.48 1RJ.1
N$25  (2 unrouted)
N$28  (1 unrouted)
N$29  (2 unrouted)
N$30  (2 unrouted)
N$31
  Bottom 0.61: HL3.C HL1.A 1R9.1
N$32  (3 unrouted)
N$33  (2 unrouted)
N$34  (2 unrouted)
N$35  (1 unrouted)
N$36  (2 unrouted)
N$39  (3 unrouted)
N$40  (1 unrouted)
N$42  (1 unrouted)
N$43  (4 unrouted)
N$44  (3 unrouted)
N$45  (1 unrouted)
N$46  (2 unrouted)
N$47  (1 unrouted)
N$48  (1 unrouted)
N$49  (3 unrouted)
N$50  (1 unrouted)
  Top 0.406: -90.17,32.7 -90.17,36.2 | -89.22,41.12 -89.22,44.61
N$51  (3 unrouted)
N$52
  Top 0.305: 2D1.15 119.12,35.66 118.9,35.88
  Top 0.406: 118.9,35.88 118.9,36.99 116.68,39.21 2R8.2
N$53
  Top 0.305: 2D1.16 118.5,35.01 117.95,35.56
  Top 0.406: 117.95,35.56 117.95,36.51 117,37.47 2R1.2
N$54
  Top 0.305: 2D1.23 118.03,30.46 2R2.2
N$55
  Top 0.305: 2D1.22 117.64,31.11
  Top 0.406: 117.64,31.11 2R3.2
N$56
  Top 0.305: 2D1.28 118.93,27.21 2Z1.2
  Top 0.61: 2Z1.2 2C1.2
N$57
  Top 0.305: 2D1.27 121.53,27.86 122.08,27.31 122.08,25.53 2Z1.1
  Top 0.61: 2Z1.1 2C2.2
N$58  (1 unrouted)
N$59  (1 unrouted)
N$60  (1 unrouted)
N$61  (1 unrouted)
N$62  (1 unrouted)
N$63  (1 unrouted)
N$64  (1 unrouted)
N$65  (4 unrouted)
N$66
  Top 0.305: 2D1.14 123.89,35.66
  Top 0.406: 123.89,35.66 120.65,38.89 2D2.5
  Bottom 0.61: 2D2.5 119.06,40.48 2R9.1
N$67
  Bottom 0.61: 2D2.8 128.27,43.34 126.36,45.4 120.01,45.4 119.06,45.08 2R10.2 2R9.2
N$68
  Top 0.305: 2D1.13 128.51,35.01 129.06,35.56 129.06,36.2 128.43,36.83
  Top 0.406: 128.43,36.83 124.3,36.83 123.19,37.94 2D2.6
  Bottom 0.61: 2R10.1 123.19,43.81 2D2.6
N$69  (1 unrouted)
N$70  (1 unrouted)
N$71  (1 unrouted)
N$72  (1 unrouted)
N$73  (2 unrouted)
N$75  (3 unrouted)
N$76  (2 unrouted)
N$78  (1 unrouted)
N$79  (2 unrouted)
N$80  (2 unrouted)
N$81  (1 unrouted)
N$82  (2 unrouted)
N$83  (2 unrouted)
N$84  (2 unrouted)
N$85  (2 unrouted)
N$86  (2 unrouted)
N$87  (1 unrouted)
N$95  (1 unrouted)
N$96  (1 unrouted)
N$111  (via drill 3 pad 5)
  other vias: 406.72,146.05
N$112  (via drill 3 pad 5)
  other vias: 422.59,146.05
N$113  (via drill 3 pad 5)
  other vias: 417.04,146.05
N$114  (via drill 3 pad 5)
  other vias: 244.63,146.05
N$115  (via drill 1 pad 2)
  other vias: 322.9,123.83
N$116  (via drill 1 pad 2)
  other vias: 341.95,123.83
N$117  (via drill 1 pad 2)
  other vias: 406.72,123.83
N$118  (via drill 1 pad 2)
  other vias: 361,123.83
N$119  (via drill 1 pad 2)
  other vias: 406.72,116.21
N$120  (via drill 1 pad 2)
  other vias: 406.72,97.16
N$121  (via drill 1 pad 2)
  other vias: 387.67,97.16
N$122  (via drill 1 pad 2)
  other vias: 368.62,97.16
N$123  (via drill 1 pad 2)
  other vias: 349.57,97.16
N$124  (via drill 1 pad 2)
  other vias: 306.7,97.16
N$125  (via drill 1 pad 2)
  other vias: 330.52,97.16
N$126  (via drill 1 pad 2)
  other vias: 267.02,85.72
N$127  (via drill 1 pad 2)
  other vias: 267.02,123.83
N$128  (via drill 1 pad 2)
  other vias: 268.6,104.78
N$129  (via drill 3 pad 5)
  other vias: 267.02,146.05
N$130  (via drill 3 pad 5)
  other vias: 322.9,146.05
N$131  (via drill 3 pad 5)
  other vias: 294.96,146.05
N$132  (via drill 3 pad 5)
  other vias: 383.86,146.05
N$133  (via drill 3 pad 5)
  other vias: 397.19,146.05
N$134  (via drill 3 pad 5)
  other vias: 341.95,146.05
N$135  (via drill 3 pad 5)
  other vias: 361,146.05
N$136  (via drill 3 pad 5)
  other vias: 244.63,123.83
N$137  (via drill 3 pad 5)
  other vias: 244.63,104.78
N$138  (via drill 3 pad 5)
  other vias: 244.63,85.72
N$250  (via drill 0.5 pad 0.61)
  other vias: 104.93,54.61
N$286  (via drill 3 pad 5)
  other vias: 165.26,54.45
N$287  (via drill 3 pad 5)
  other vias: 175.58,54.45
N$288  (via drill 3 pad 5)
  other vias: 3.17,54.45
N$291  (via drill 1 pad 2)
  other vias: 165.26,32.23
N$293  (via drill 1 pad 2)
  other vias: 165.26,24.61
N$294  (via drill 1 pad 2)
  other vias: 165.26,5.56
N$295  (via drill 1 pad 2)
  other vias: 146.21,5.56
N$296  (via drill 1 pad 2)
  other vias: 127.16,5.56
N$297  (via drill 1 pad 2)
  other vias: 108.11,5.56
N$305  (via drill 1 pad 2)
  other vias: 65.25,5.56
N$306  (via drill 1 pad 2)
  other vias: 89.06,5.56
N$330  (via drill 3 pad 5)
  other vias: 25.56,54.45
N$331  (via drill 3 pad 5)
  other vias: 81.44,54.45
N$332  (via drill 3 pad 5)
  other vias: 53.5,54.45
N$333  (via drill 3 pad 5)
  other vias: 142.4,54.45
N$334  (via drill 3 pad 5)
  other vias: 155.73,54.45
N$335  (via drill 3 pad 5)
  other vias: 100.49,54.45
N$336  (via drill 3 pad 5)
  other vias: 119.54,54.45
N$337  (via drill 3 pad 5)
  other vias: 3.17,32.23
N$338  (via drill 3 pad 5)
  other vias: 3.17,13.18
N$395  (via drill 3 pad 5)
  other vias: 181.13,54.45
PD2  (1 unrouted)
PD5  (1 unrouted)
PD7  (2 unrouted)
PPC2(!OE!)  (2 unrouted)
RD+  (1 unrouted)
  Top 0.305: 1D1.11 100.15,36.53
  Top 0.406: 100.15,36.53 100.19,36.53 100.49,36.83 102.08,36.83 103.98,38.74 J_U1.1
RD-  (1 unrouted)
  Top 0.305: 1D1.10 102.72,35.89
  Top 0.406: 102.72,35.89 105.57,38.74 105.57,42.76 J_U2.2
RESET0  (2 unrouted)
RESET8535  (5 unrouted)
RESET(P)  (2 unrouted)
RX_AVR  (1 unrouted)
RX_USB  (3 unrouted)
SCK0  (1 unrouted)
SCK8535  (4 unrouted)
SWCLK(XTAL1)  (1 unrouted)
TRST(RESET)  (3 unrouted)
TX_AVR  (1 unrouted)
TX_USB  (4 unrouted)
UCAP
  Top 0.406: 4D1.6 -83.98,31.91 C2.1
UGND  (1 unrouted)
  Top 0.406: 4D1.5 -83.18,31.44 -81.92,32.7 -81.92,33.43 C2.2
UMISO(D1)  (1 unrouted)
  Top 0.406: 4D1.11 -87.98,31.62 -88.42,32.07 DATA3.1
UMOSI(D2)  (1 unrouted)
  Top 0.406: 4D1.10 -87.18,34.42 -86.68,34.93 DATA2.1
UPB0
  Top 0.406: 4D1.8 -85.58,33.17 -83.82,34.93 -83.82,37.15 -83.03,37.94 DATA0.1
UPB4  (1 unrouted)
  Top 0.406: 4D1.28 -83.98,16.99 -81.6,13.81 DATA4.1
UPB5  (3 unrouted)
  Top 0.406: 4D1.29 -83.18,17.3 -80.8,14.13 -80.01,12.7 DATA5.1
UPB6  (3 unrouted)
  Top 0.406: 4D1.30 -82.38,17.45 -78.26,12.54 DATA6.1
UPB7  (3 unrouted)
  Top 0.406: -90.17,28.2 4D1.12
  Top 0.61: DATA7.1 -90.17,28.2 -90.17,28.1
UPC6  (1 unrouted)
UPC7  (2 unrouted)
UPD0
  Top 0.406: 4D1.18 -91.92,23.17 -97.31,18.1 -97.31,15.4 -97.32,15.4 R15.1
UPD1  (1 unrouted)
  Top 0.406: 4D1.19 -91.45,22.37 -95.41,18.42 R/!B.1
UPD3  (1 unrouted)
  Top 0.406: 4D1.21 -90.51,20.77 -91.92,19.37 !WR.1
UPD4  (1 unrouted)
  Top 0.406: 4D1.25 -86.38,14.75 BS1.1
UPD5  (1 unrouted)
  Top 0.406: XA0.1 -90.01,19.58 4D1.22
UPD6  (1 unrouted)
  Top 0.406: 4D1.26 -85.58,16.21 -84.93,15.24 XA1.1
UPD7  (1 unrouted)
  Top 0.406: 4D1.27 -84.78,16.52 -83.19,14.45 PAG.1
UPE6  (1 unrouted)
UPF0  (1 unrouted)
UPF1  (1 unrouted)
UPF4  (1 unrouted)
UPF5  (1 unrouted)
UPF6  (1 unrouted)
UPF7  (1 unrouted)
URESET  (4 unrouted)
  Top 0.406: 4D1.13 -90.67,27.17 -91.6,28.1 -91.6,29.37 -92.39,30.16 R1.1
  Top 0.61: RES.1 R1.1
  Bottom 0.61: RESET.C RES.1
USCK(D3)  (1 unrouted)
  Top 0.406: 4D1.9 -86.38,33.64 -86.36,33.81 -85.73,34.45 -84.77,35.24 DATA1.1
UU+
  Top 0.305: 1D1.7 106.52,33.97
  Top 0.406: 106.52,33.97 111.76,39.21 2R8.1 2R4.2
UU-
  Top 0.305: 1D1.6 107.47,33.33
  Top 0.406: 107.47,33.33 111.6,37.47 2R1.1
VCC  (4 unrouted)
VD1V8
  Top 0.305: 1D1.12 97.65,37.17 | 94.42,30.13 1D1.28
  Top 0.406: 1C4.1 94.42,29.25 94.42,30.13 96.68,31.43 96.68,36.2 97.65,37.17
  Top 0.61: 1C3.1 1C4.1
VD3V3
  Top 0.305: 1R4.1 83.98,32.7 88.11,32.7 90.33,34.61 1D1.21 94.77,34.61 | 1D1.13 96.71,37.81
  Top 0.406: 94.77,34.61 95.73,35.56 95.73,36.83 96.71,37.81
  Top 0.61: 1R4.1 1R3.1 1C5.1 1C6.1 1R5.1
VIN  (1 unrouted)
VTG  (3 unrouted)
VUSB  (via drill 0.6 pad 2)  (1 unrouted)
  Top 0.305: 1D1.20 90.02,35.25 88.74,34.93 87.16,34.93 1R6.2
  Top 0.406: 4D1.7 -84.78,32.7 -82.87,34.61 -82.87,36.83 -81.28,38.42 -81.28,41.59
  Top 0.61: 1R6.2 87.07,34.29 v85.25,34.29
  Bottom 0.61: v85.25,34.29 85.88,34.29 1C9.2 95.09,37.47 102.71,37.47 106.2,40.64
  Bottom 1.016: 1C8.2 1C7.+ F1.1 82.71,38.78 v85.25,34.29
VUSBH
  Bottom 0.305: F2.2 F2.1
  Bottom 0.61: 1C10.1 117,47.31 116.68,46.99 113.66,44.49 1X2.1
  Bottom 1.016: F2.2 113.51,41.08 1X2.1
XTAL1
  Top 0.406: 4D1.17 -92.36,23.97 R100.2
  Top 0.61: XTAL1.1 -98.37,17.84 C20.2 Z1.3 Z1A.2 R100.2
XTAL2
  Top 0.406: 4D1.16 -92.21,24.77 R100.1
  Top 0.61: Z1.1 C24.1 -100.11,27.21 -99.22,28.1 -97.44,28.1 Z1A.1 R100.1

## Text on the board
Bottom: 1179-16